# Altium project astable.PrjPcb
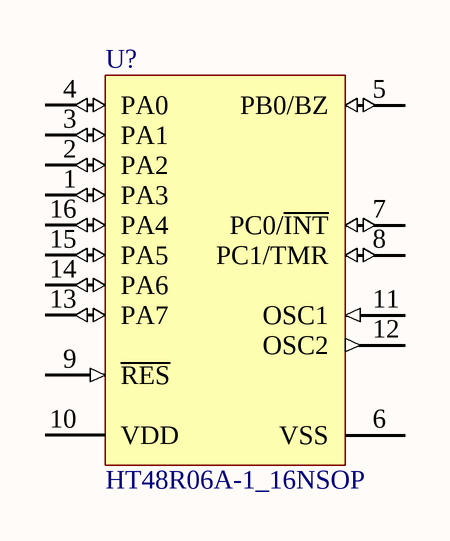
[diagram p0: Sheet1.SchDoc]
1 sheet, 1 parts. Net scope: global (net labels, ports and power ports of the same name join across sheets).
Board file: PCB1.PcbDoc

## Sheet Sheet1.SchDoc
size A4; SheetNumber: 1; SheetTotal: 1

### Parts
U?  HT48R06A-1_16NSOP  [16NSOP_M]

### Nets

Not connected (* = marked no-connect by the designer): U? 1(PA3) 2(PA2) 3(PA1) 4(PA0) 5(PB0/BZ) 6(VSS) 7(PC0/~{INT}) 8(PC1/TMR) 9(~{RES}) 10(VDD) 11(OSC1) 12(OSC2) 13(PA7) 14(PA6) 15(PA5) 16(PA4)

### Library data of the parts
U? = CMP-0206-00112-1: General Purpose MCU, Cost-Effective I/O Type MCU, 2.2V-5.5V, 400kHz-8MHz, 1Kx14 Program Memory, 64x8 Data Memory, 13 I/O, 1 x 8-bit Timer, 16-pin NSOP; I/O: 13; PackageReference: 16NSOP; Data Memory: 64x8; PackageVersion: May-2010; Program Memory: 1Kx14; DatasheetVersion: rev1.51, Dec-2008; Operating Voltage: 2.2V-5.5V; Series: Cost-Effective I/O Type MCU; PackageDescription: 16-Pin Narrow Small Outline Package, 150mil Wide, 1.27 mm Pitch